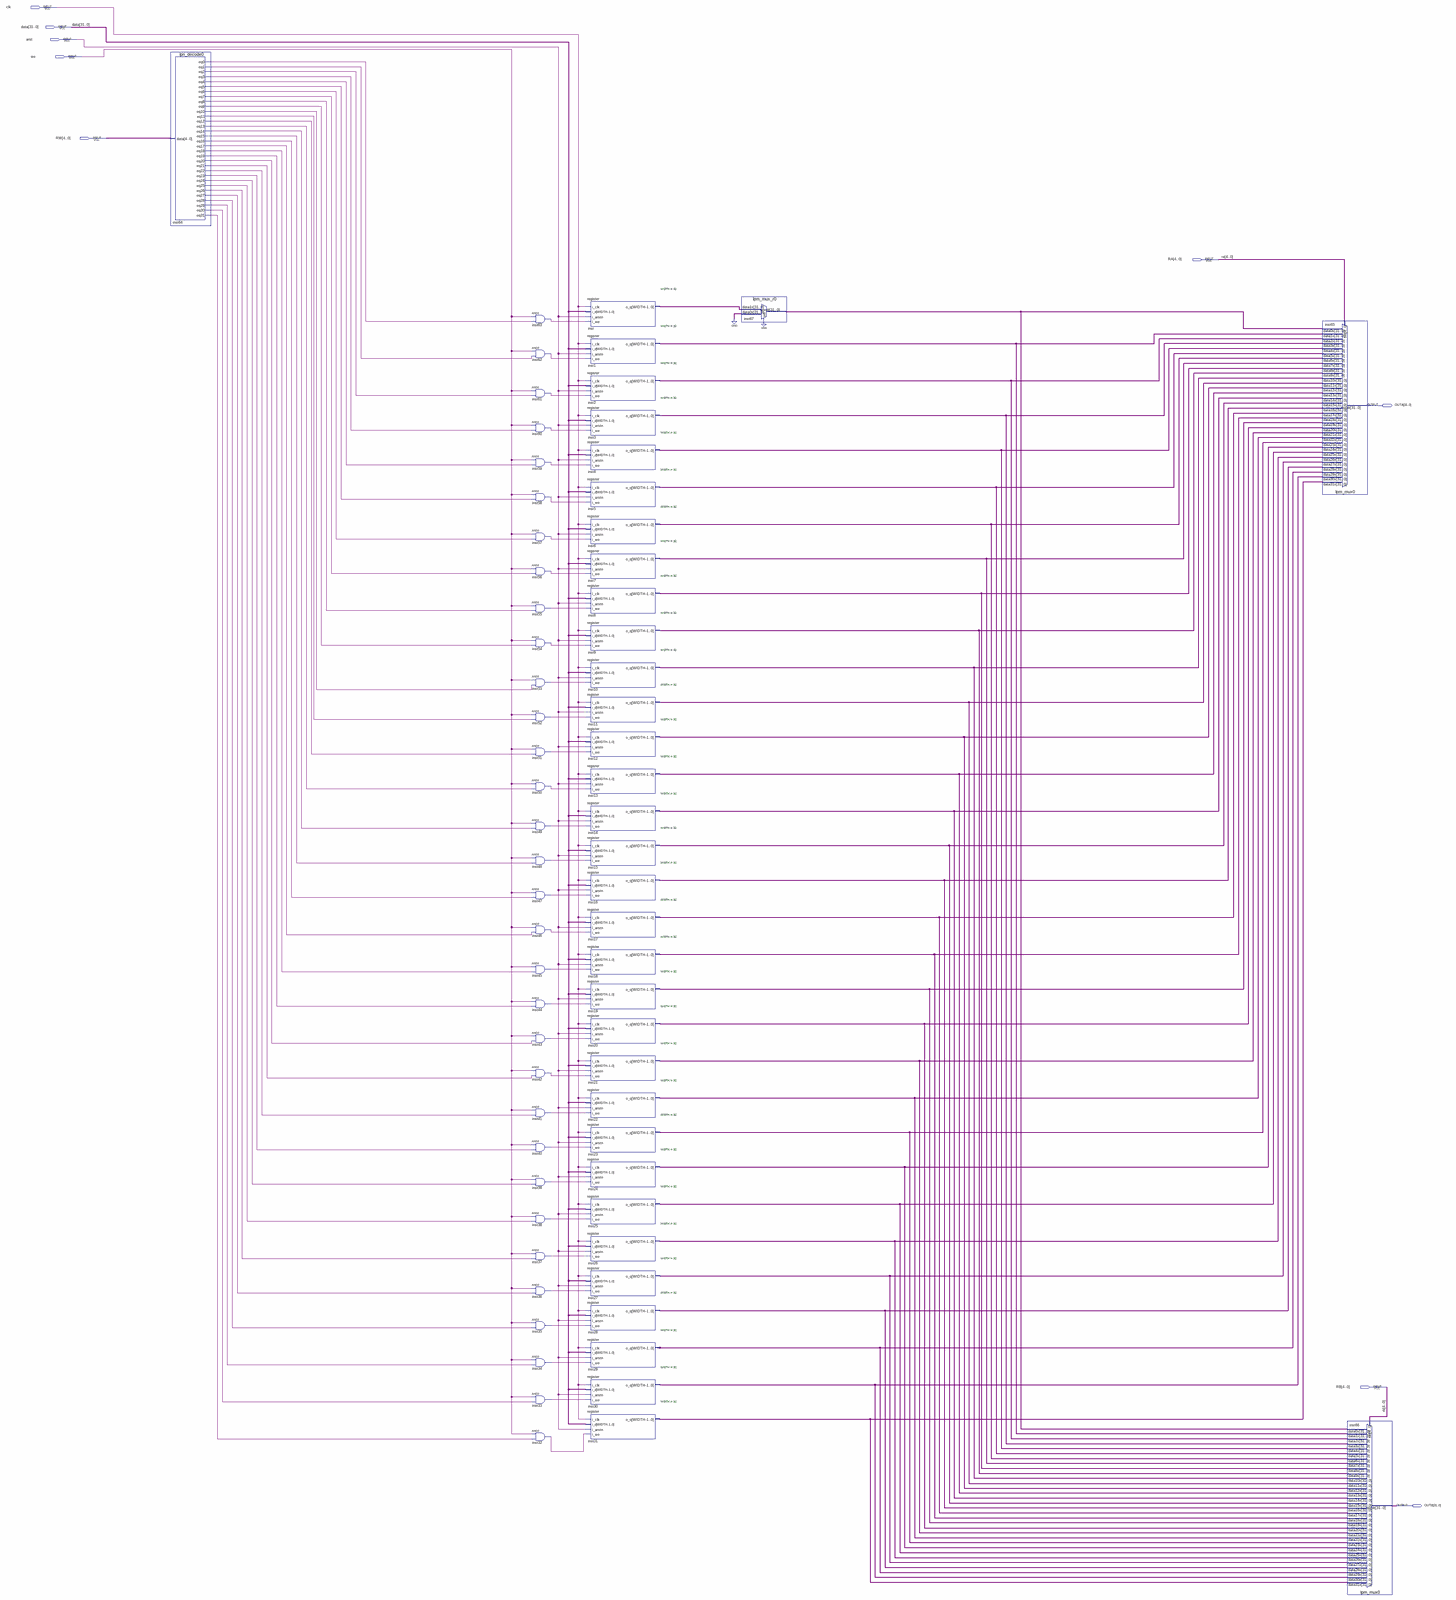
[diagram p0: schematic sheet, whole]
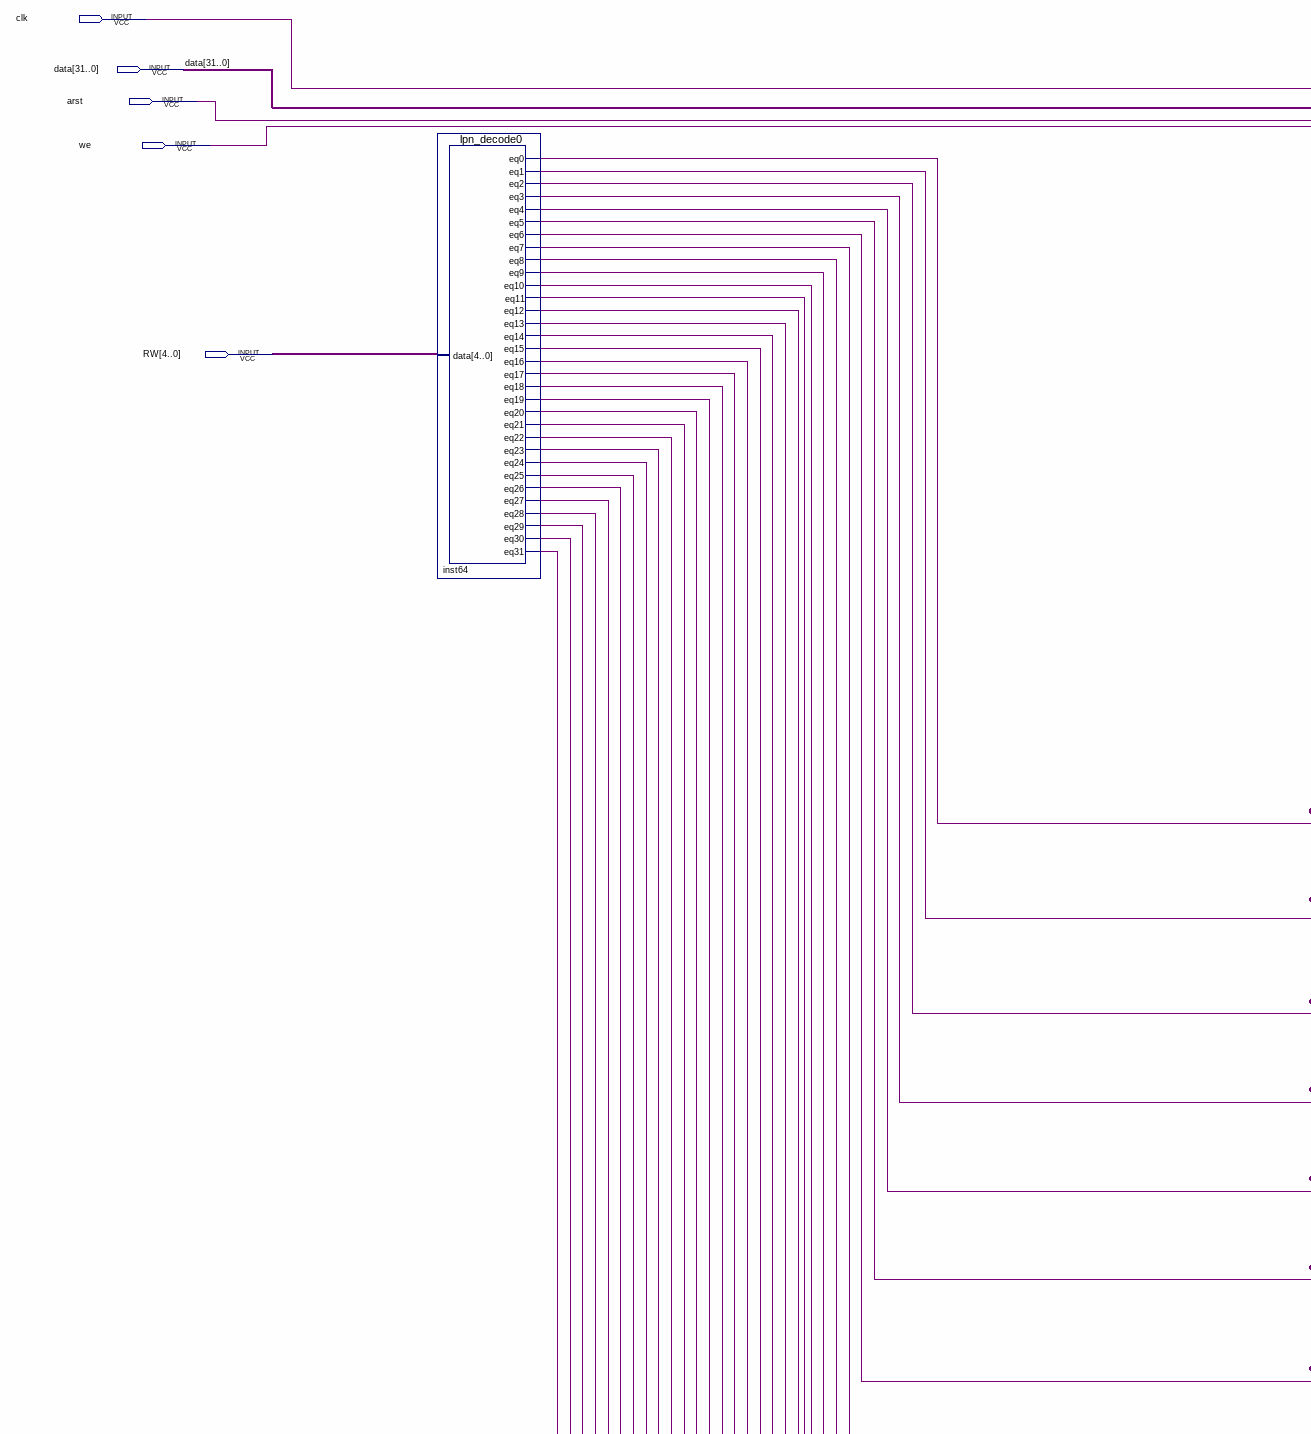
[diagram p1: schematic sheet, upper left part]
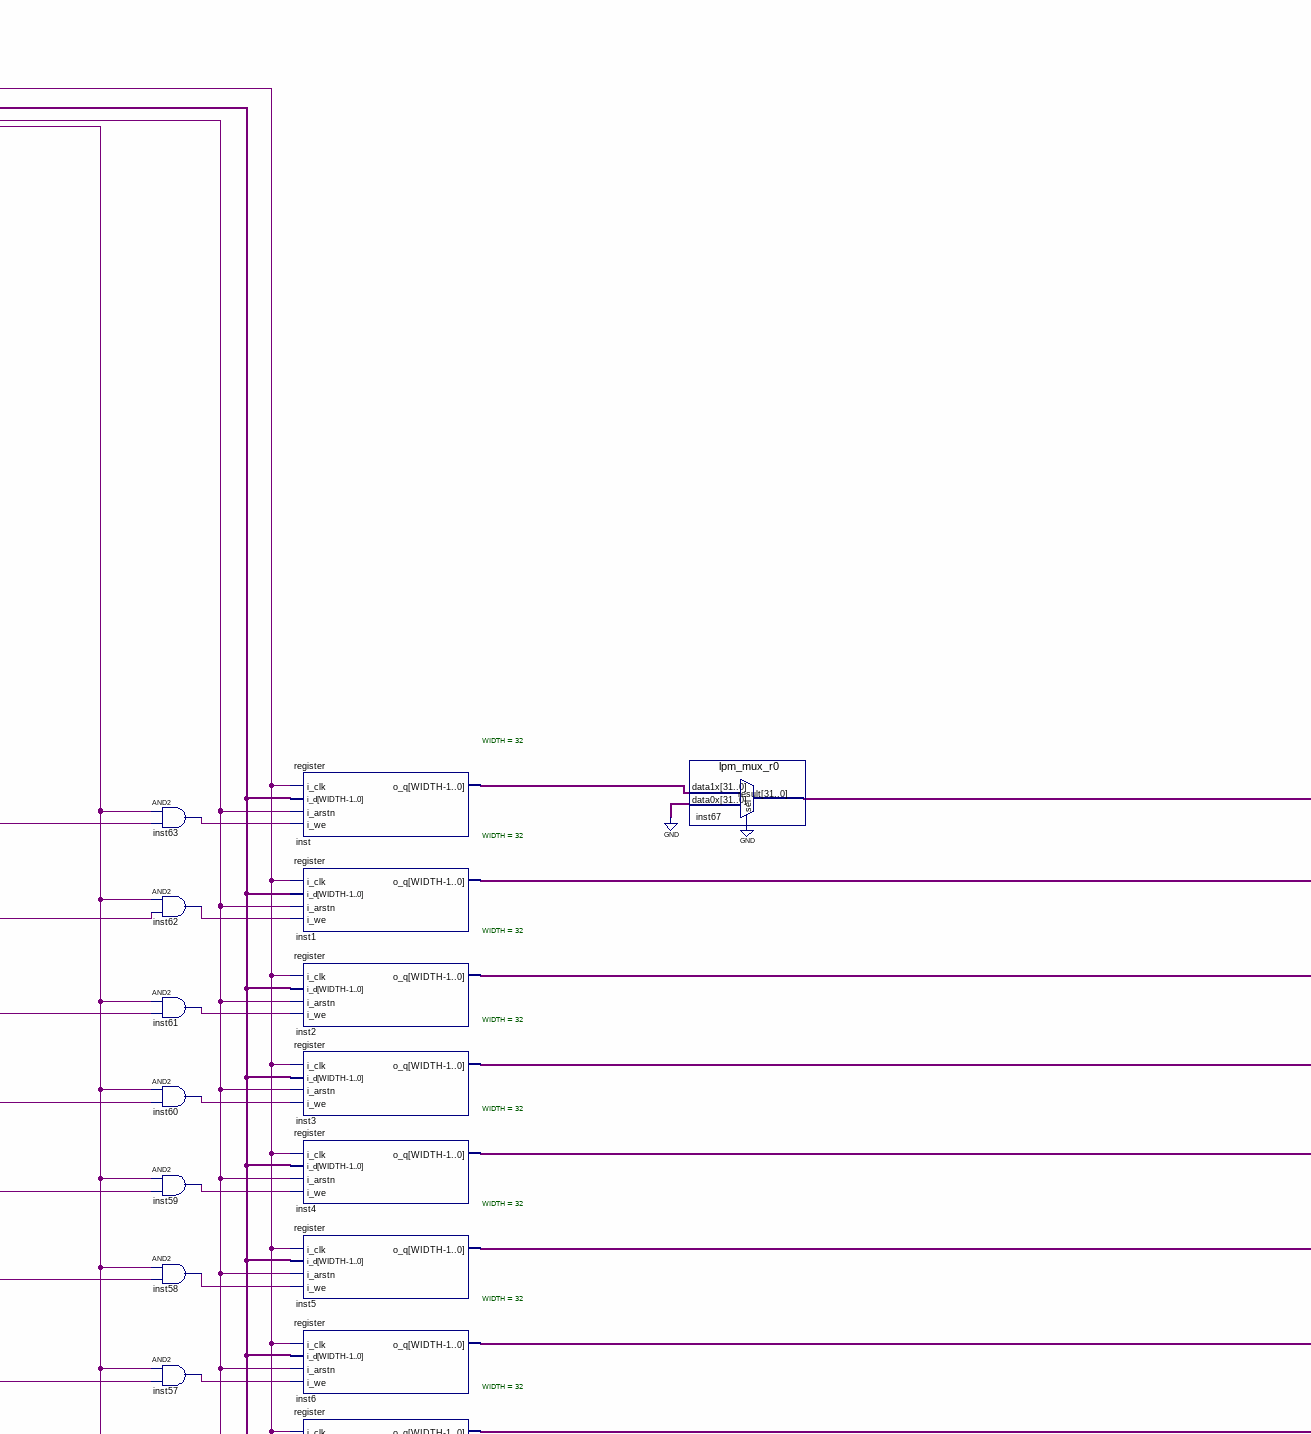
[diagram p2: schematic sheet, upper centre part]
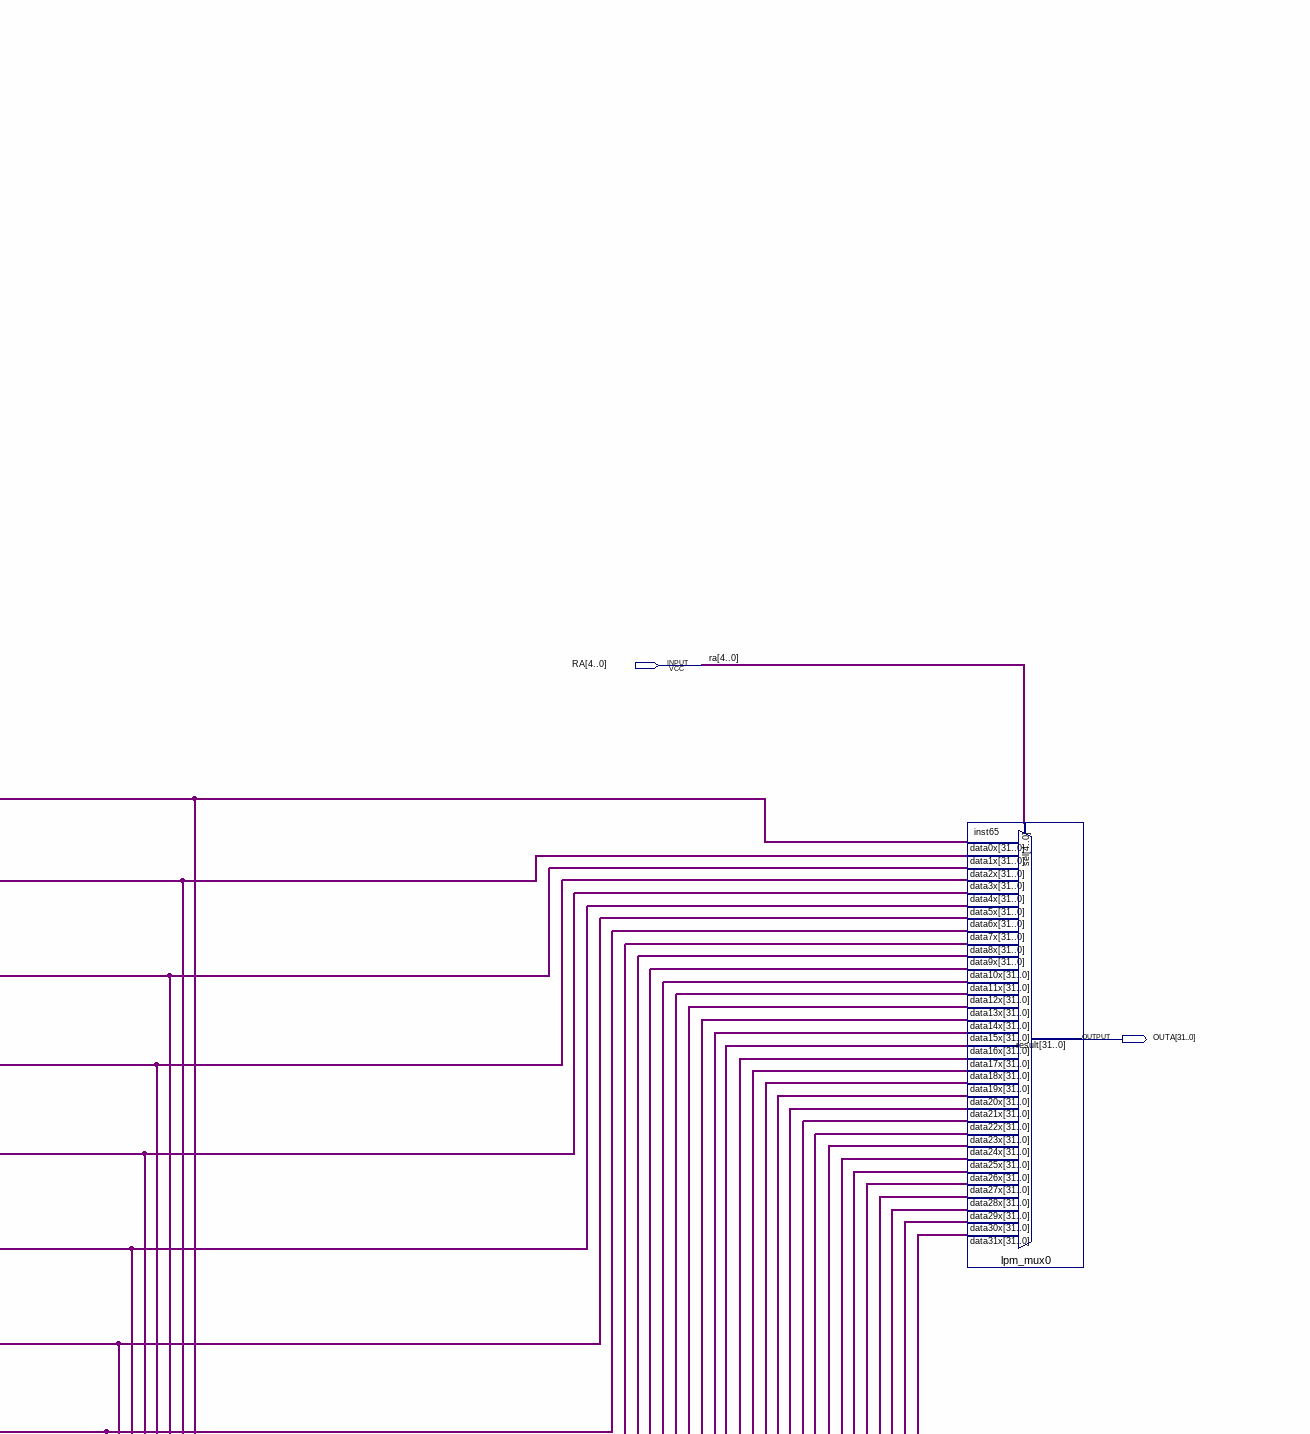
[diagram p3: schematic sheet, upper right part]
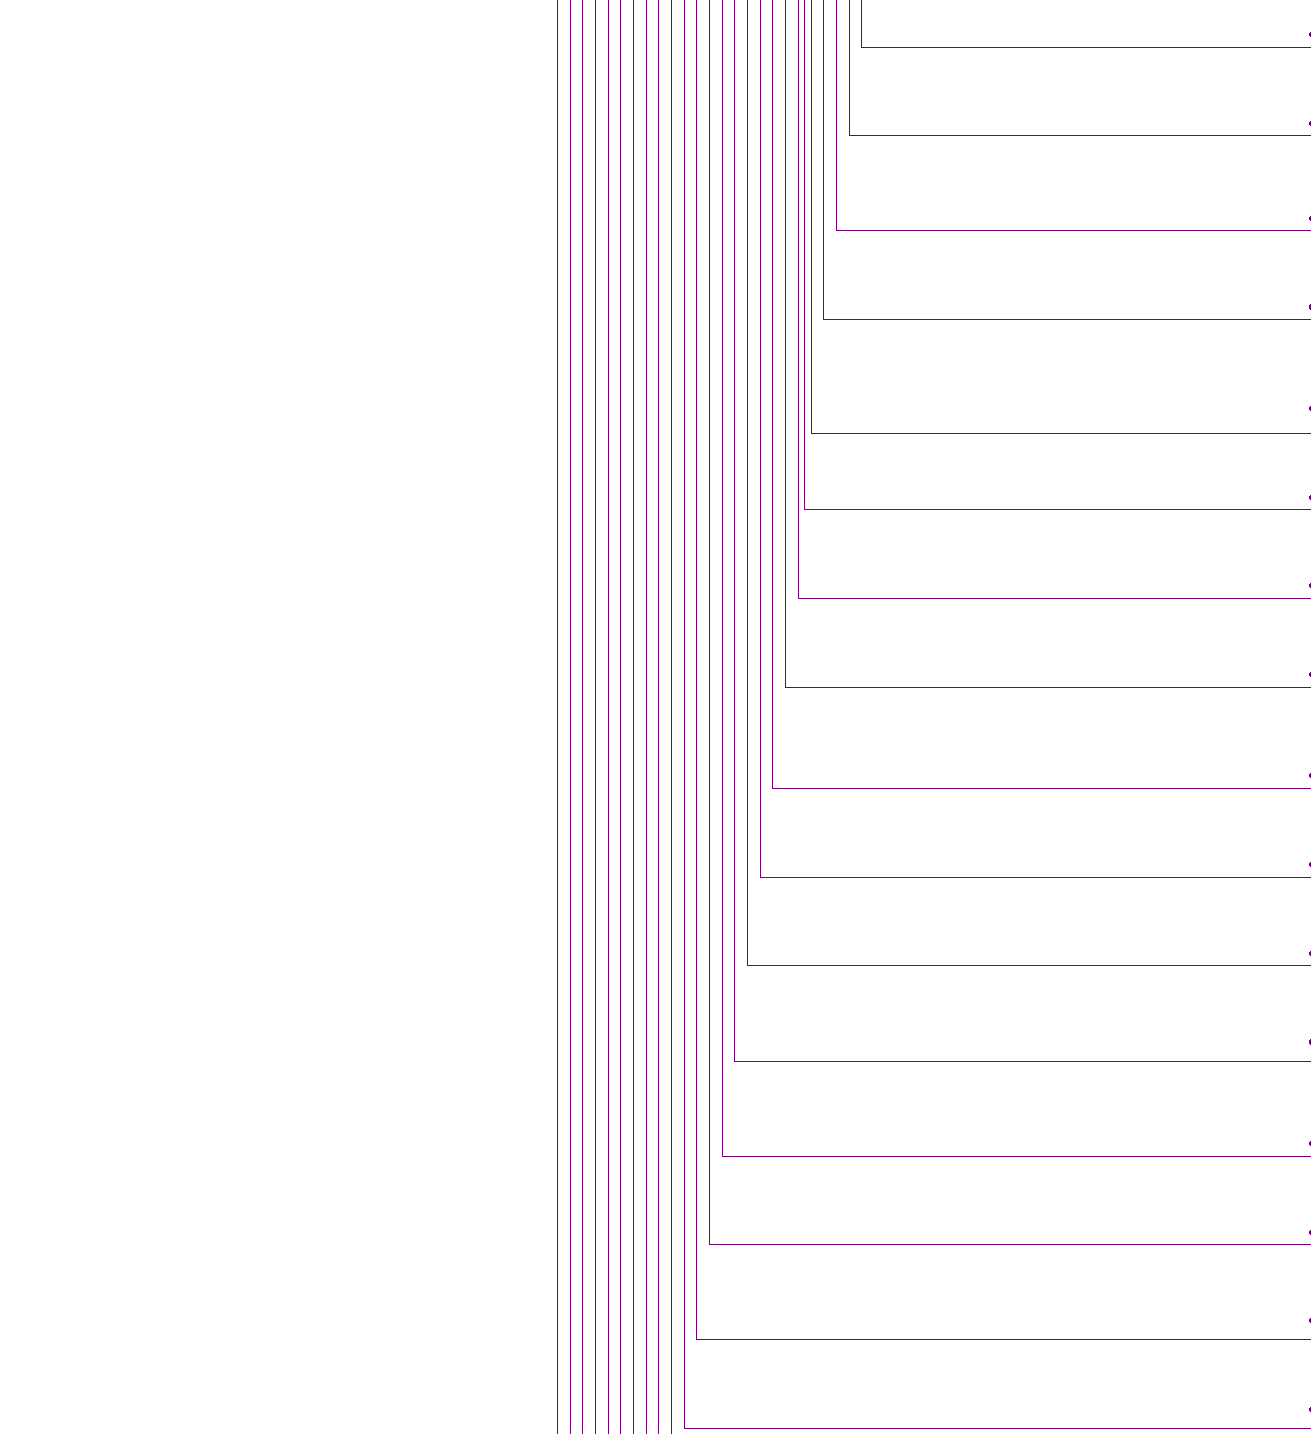
[diagram p4: schematic sheet, middle left part]
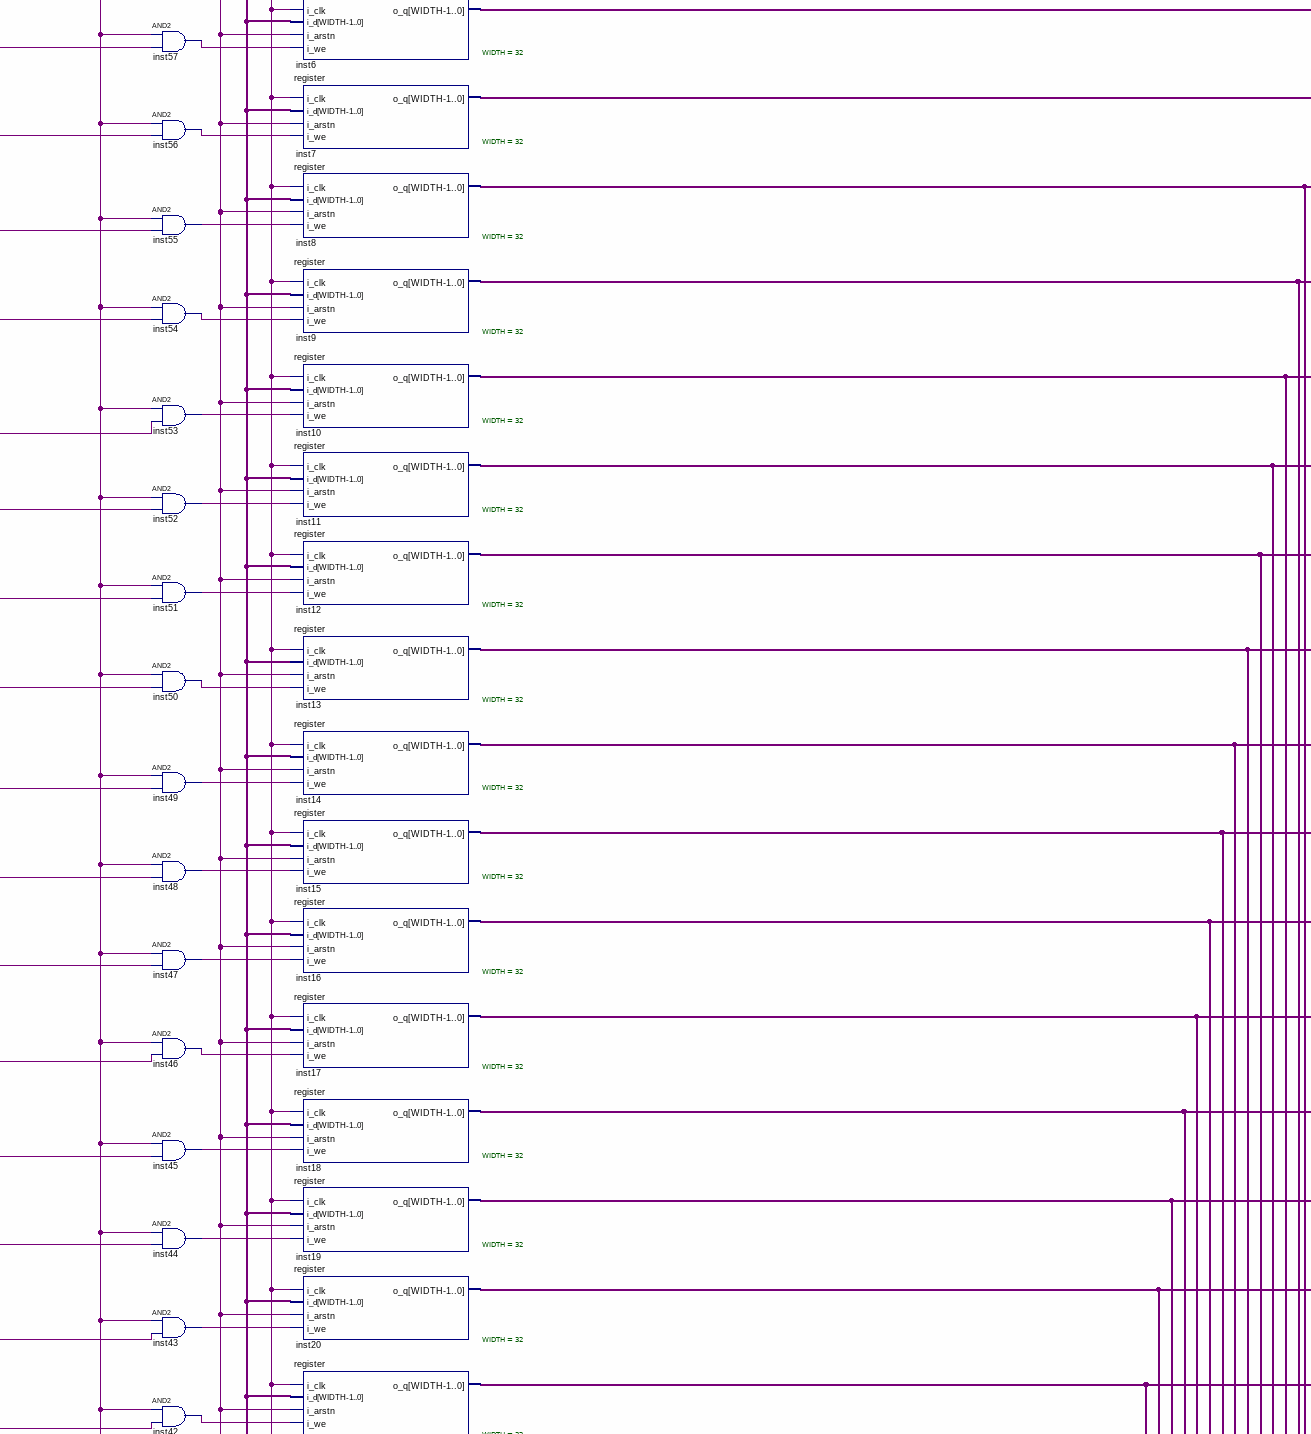
[diagram p5: schematic sheet, middle centre part]
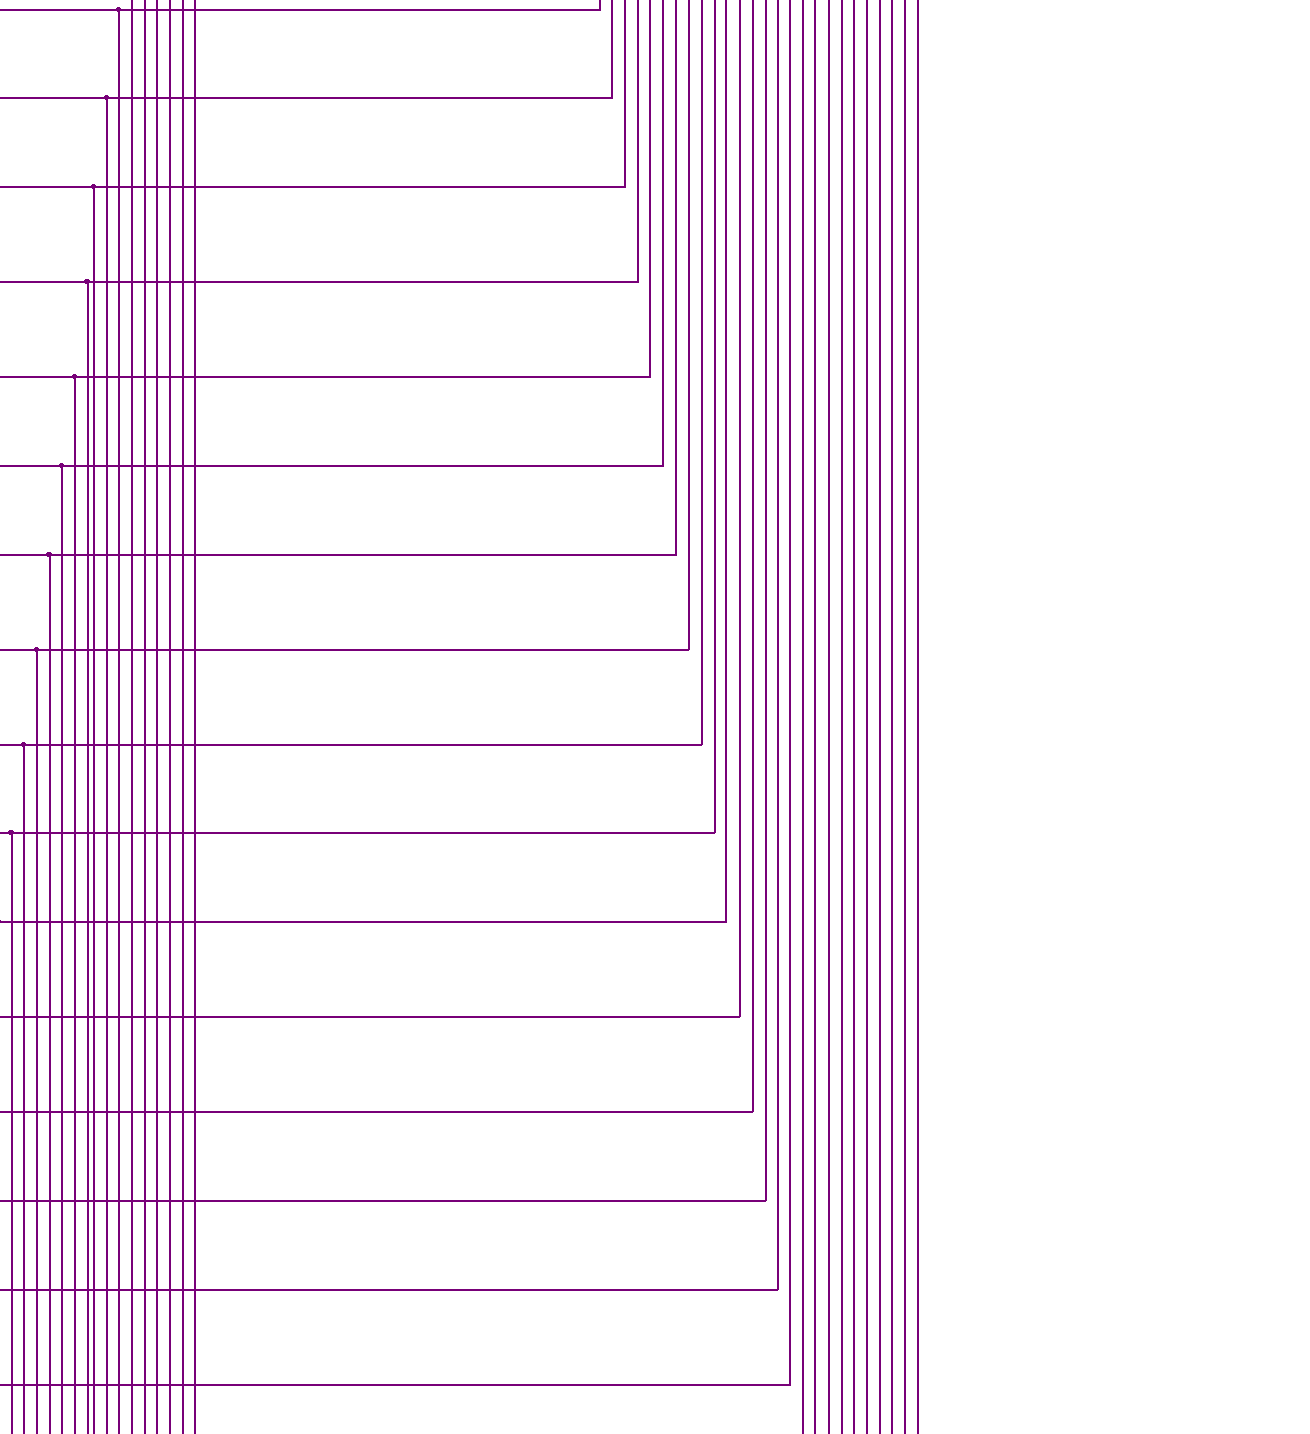
[diagram p6: schematic sheet, middle right part]
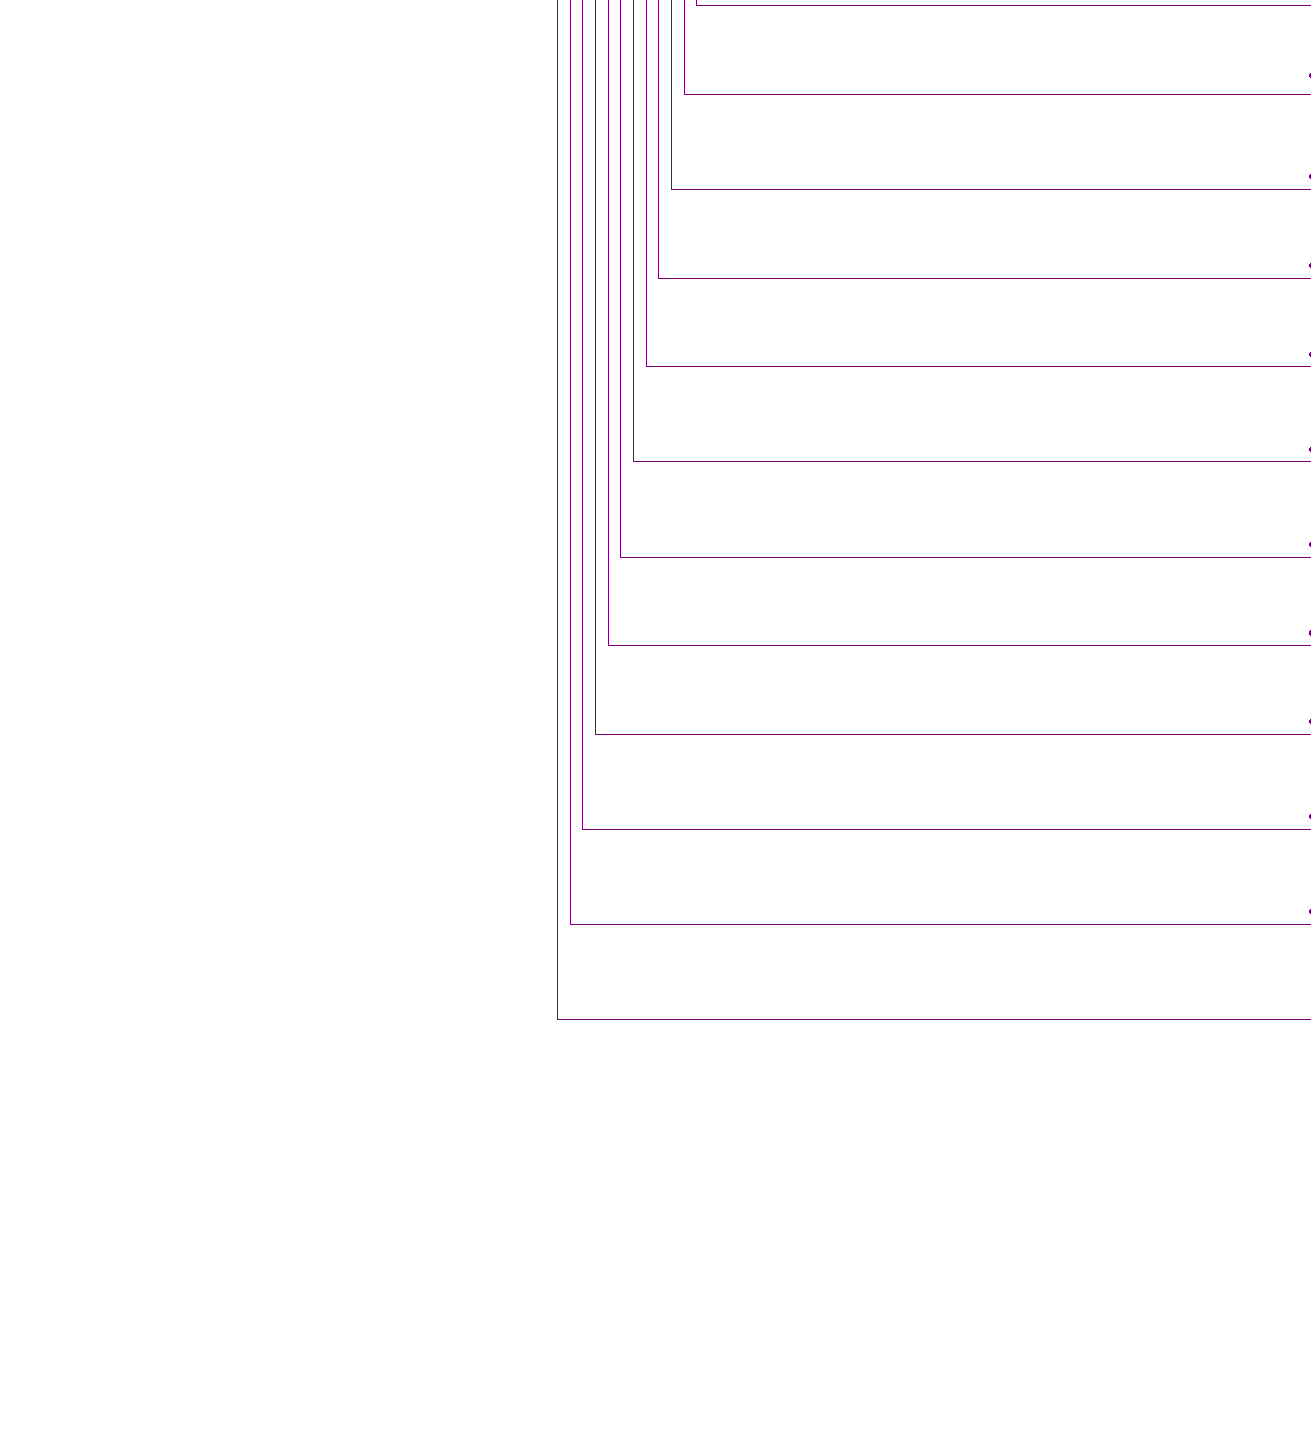
[diagram p7: schematic sheet, lower left part]
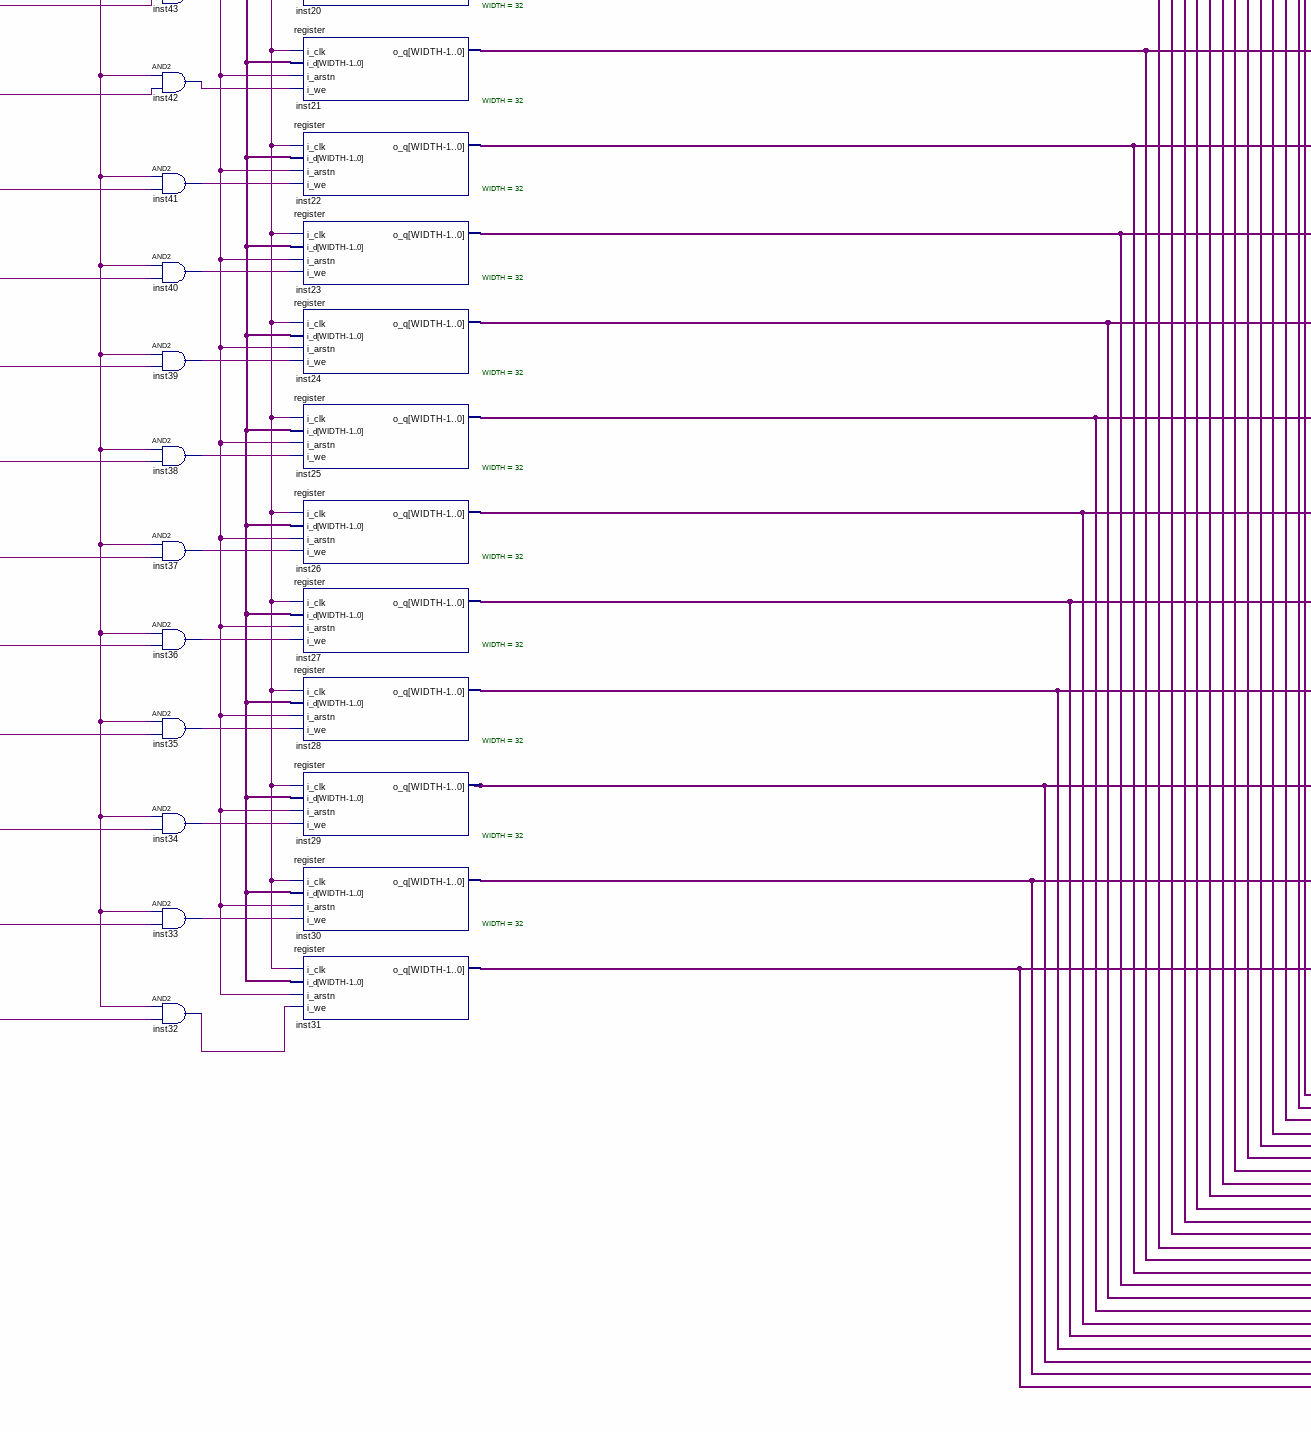
[diagram p8: schematic sheet, lower centre part]
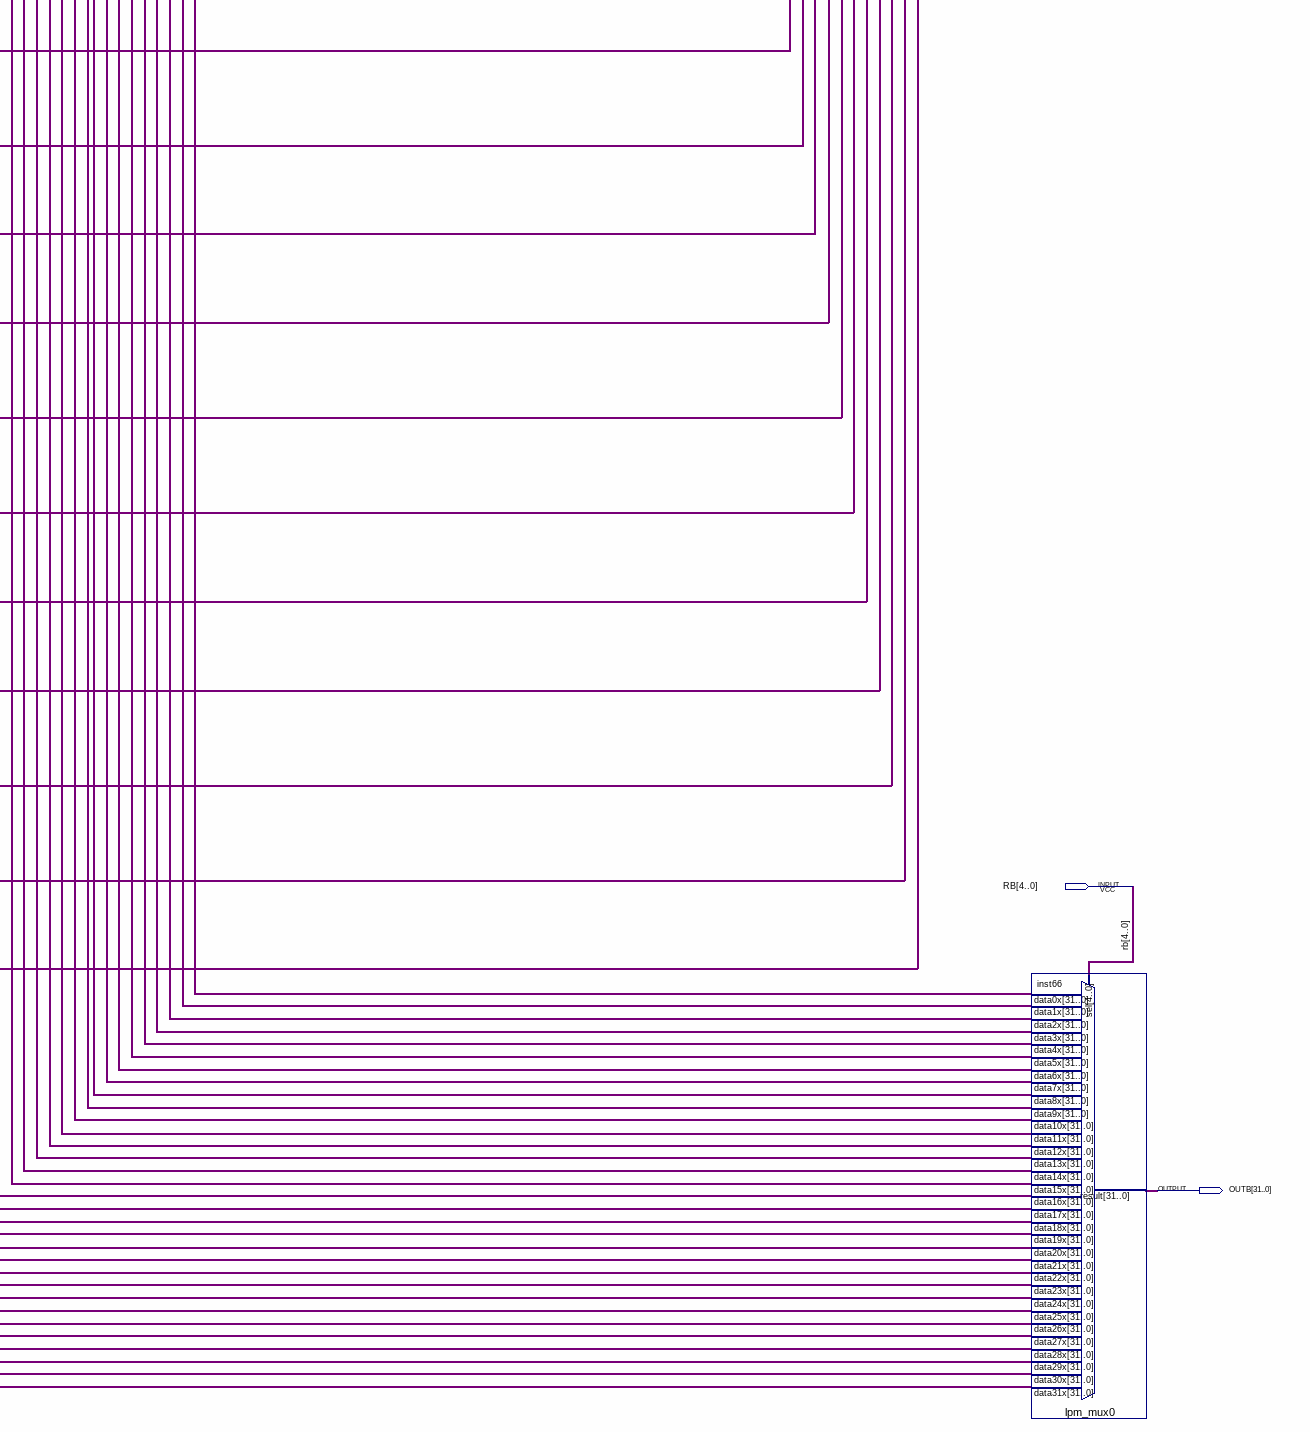
[diagram p9: schematic sheet, lower right part]
// Quartus schematic lab2.bdf as structural Verilog: 68 symbols, 9 pins
module lab2 (
  input  clk,
  input  [31:0] data,
  input  arst,
  input  we,
  input  [4:0] RW,
  input  [4:0] RA,
  input  [4:0] RB,
  output [31:0] OUTA,
  output [31:0] OUTB
);

  wire inst32_out, inst33_out, inst34_out, inst35_out, inst36_out, inst37_out, inst38_out, inst39_out,
       inst40_out, inst41_out, inst42_out, inst43_out, inst44_out, inst45_out, inst46_out, inst47_out,
       inst48_out, inst49_out, inst50_out, inst51_out, inst52_out, inst53_out, inst54_out, inst55_out,
       inst56_out, inst57_out, inst58_out, inst59_out, inst60_out, inst61_out, inst62_out, inst63_out,
       inst64_eq0, inst64_eq1, inst64_eq2, inst64_eq3, inst64_eq4, inst64_eq5, inst64_eq6, inst64_eq7,
       inst64_eq8, inst64_eq9, inst64_eq10, inst64_eq11, inst64_eq12, inst64_eq13, inst64_eq14, inst64_eq15,
       inst64_eq16, inst64_eq17, inst64_eq18, inst64_eq19, inst64_eq20, inst64_eq21, inst64_eq22,
       inst64_eq23, inst64_eq24, inst64_eq25, inst64_eq26, inst64_eq27, inst64_eq28, inst64_eq29,
       inst64_eq30, inst64_eq31;
  wire [31:0] inst1_o_q, inst2_o_q, inst3_o_q, inst4_o_q, inst5_o_q, inst6_o_q, inst7_o_q, inst8_o_q,
       inst9_o_q, inst10_o_q, inst11_o_q, inst12_o_q, inst13_o_q, inst14_o_q, inst15_o_q, inst16_o_q,
       inst17_o_q, inst18_o_q, inst19_o_q, inst20_o_q, inst21_o_q, inst22_o_q, inst23_o_q, inst24_o_q,
       inst25_o_q, inst26_o_q, inst27_o_q, inst28_o_q, inst29_o_q, inst30_o_q, inst31_o_q, inst67_result,
       inst_o_q;

  lpn_decode0 inst64 (
    .data(RW), .eq0(inst64_eq0), .eq1(inst64_eq1), .eq2(inst64_eq2), .eq3(inst64_eq3), .eq4(inst64_eq4),
    .eq5(inst64_eq5), .eq6(inst64_eq6), .eq7(inst64_eq7), .eq8(inst64_eq8), .eq9(inst64_eq9),
    .eq10(inst64_eq10), .eq11(inst64_eq11), .eq12(inst64_eq12), .eq13(inst64_eq13), .eq14(inst64_eq14),
    .eq15(inst64_eq15), .eq16(inst64_eq16), .eq17(inst64_eq17), .eq18(inst64_eq18), .eq19(inst64_eq19),
    .eq20(inst64_eq20), .eq21(inst64_eq21), .eq22(inst64_eq22), .eq23(inst64_eq23), .eq24(inst64_eq24),
    .eq25(inst64_eq25), .eq26(inst64_eq26), .eq27(inst64_eq27), .eq28(inst64_eq28), .eq29(inst64_eq29),
    .eq30(inst64_eq30), .eq31(inst64_eq31));
  and inst63 (inst63_out, we, inst64_eq0);
  and inst62 (inst62_out, we, inst64_eq1);
  and inst61 (inst61_out, we, inst64_eq2);
  and inst60 (inst60_out, we, inst64_eq3);
  and inst59 (inst59_out, we, inst64_eq4);
  and inst58 (inst58_out, we, inst64_eq5);
  and inst57 (inst57_out, we, inst64_eq6);
  and inst56 (inst56_out, we, inst64_eq7);
  and inst55 (inst55_out, we, inst64_eq8);
  and inst54 (inst54_out, we, inst64_eq9);
  and inst53 (inst53_out, we, inst64_eq10);
  and inst52 (inst52_out, we, inst64_eq11);
  and inst51 (inst51_out, we, inst64_eq12);
  and inst50 (inst50_out, we, inst64_eq13);
  and inst49 (inst49_out, we, inst64_eq14);
  and inst48 (inst48_out, we, inst64_eq15);
  and inst47 (inst47_out, we, inst64_eq16);
  and inst46 (inst46_out, we, inst64_eq17);
  and inst45 (inst45_out, we, inst64_eq18);
  and inst44 (inst44_out, we, inst64_eq19);
  and inst43 (inst43_out, we, inst64_eq20);
  and inst42 (inst42_out, we, inst64_eq21);
  and inst41 (inst41_out, we, inst64_eq22);
  and inst40 (inst40_out, we, inst64_eq23);
  and inst39 (inst39_out, we, inst64_eq24);
  and inst38 (inst38_out, we, inst64_eq25);
  and inst37 (inst37_out, we, inst64_eq26);
  and inst36 (inst36_out, we, inst64_eq27);
  and inst35 (inst35_out, we, inst64_eq28);
  and inst34 (inst34_out, we, inst64_eq29);
  and inst33 (inst33_out, we, inst64_eq30);
  and inst32 (inst32_out, we, inst64_eq31);
  register #(.WIDTH(32)) inst (.i_clk(clk), .i_d(data), .i_arstn(arst), .i_we(inst63_out), .o_q(inst_o_q));
  register #(.WIDTH(32)) inst1 (.i_clk(clk), .i_d(data), .i_arstn(arst), .i_we(inst62_out), .o_q(inst1_o_q));
  register #(.WIDTH(32)) inst2 (.i_clk(clk), .i_d(data), .i_arstn(arst), .i_we(inst61_out), .o_q(inst2_o_q));
  register #(.WIDTH(32)) inst3 (.i_clk(clk), .i_d(data), .i_arstn(arst), .i_we(inst60_out), .o_q(inst3_o_q));
  register #(.WIDTH(32)) inst4 (.i_clk(clk), .i_d(data), .i_arstn(arst), .i_we(inst59_out), .o_q(inst4_o_q));
  register #(.WIDTH(32)) inst5 (.i_clk(clk), .i_d(data), .i_arstn(arst), .i_we(inst58_out), .o_q(inst5_o_q));
  register #(.WIDTH(32)) inst6 (.i_clk(clk), .i_d(data), .i_arstn(arst), .i_we(inst57_out), .o_q(inst6_o_q));
  register #(.WIDTH(32)) inst7 (.i_clk(clk), .i_d(data), .i_arstn(arst), .i_we(inst56_out), .o_q(inst7_o_q));
  register #(.WIDTH(32)) inst8 (.i_clk(clk), .i_d(data), .i_arstn(arst), .i_we(inst55_out), .o_q(inst8_o_q));
  register #(.WIDTH(32)) inst9 (.i_clk(clk), .i_d(data), .i_arstn(arst), .i_we(inst54_out), .o_q(inst9_o_q));
  register #(.WIDTH(32)) inst10 (.i_clk(clk), .i_d(data), .i_arstn(arst), .i_we(inst53_out), .o_q(inst10_o_q));
  register #(.WIDTH(32)) inst11 (.i_clk(clk), .i_d(data), .i_arstn(arst), .i_we(inst52_out), .o_q(inst11_o_q));
  register #(.WIDTH(32)) inst12 (.i_clk(clk), .i_d(data), .i_arstn(arst), .i_we(inst51_out), .o_q(inst12_o_q));
  register #(.WIDTH(32)) inst13 (.i_clk(clk), .i_d(data), .i_arstn(arst), .i_we(inst50_out), .o_q(inst13_o_q));
  register #(.WIDTH(32)) inst14 (.i_clk(clk), .i_d(data), .i_arstn(arst), .i_we(inst49_out), .o_q(inst14_o_q));
  register #(.WIDTH(32)) inst15 (.i_clk(clk), .i_d(data), .i_arstn(arst), .i_we(inst48_out), .o_q(inst15_o_q));
  register #(.WIDTH(32)) inst16 (.i_clk(clk), .i_d(data), .i_arstn(arst), .i_we(inst47_out), .o_q(inst16_o_q));
  register #(.WIDTH(32)) inst17 (.i_clk(clk), .i_d(data), .i_arstn(arst), .i_we(inst46_out), .o_q(inst17_o_q));
  register #(.WIDTH(32)) inst18 (.i_clk(clk), .i_d(data), .i_arstn(arst), .i_we(inst45_out), .o_q(inst18_o_q));
  register #(.WIDTH(32)) inst19 (.i_clk(clk), .i_d(data), .i_arstn(arst), .i_we(inst44_out), .o_q(inst19_o_q));
  register #(.WIDTH(32)) inst20 (.i_clk(clk), .i_d(data), .i_arstn(arst), .i_we(inst43_out), .o_q(inst20_o_q));
  register #(.WIDTH(32)) inst21 (.i_clk(clk), .i_d(data), .i_arstn(arst), .i_we(inst42_out), .o_q(inst21_o_q));
  register #(.WIDTH(32)) inst22 (.i_clk(clk), .i_d(data), .i_arstn(arst), .i_we(inst41_out), .o_q(inst22_o_q));
  register #(.WIDTH(32)) inst23 (.i_clk(clk), .i_d(data), .i_arstn(arst), .i_we(inst40_out), .o_q(inst23_o_q));
  register #(.WIDTH(32)) inst24 (.i_clk(clk), .i_d(data), .i_arstn(arst), .i_we(inst39_out), .o_q(inst24_o_q));
  register #(.WIDTH(32)) inst25 (.i_clk(clk), .i_d(data), .i_arstn(arst), .i_we(inst38_out), .o_q(inst25_o_q));
  register #(.WIDTH(32)) inst26 (.i_clk(clk), .i_d(data), .i_arstn(arst), .i_we(inst37_out), .o_q(inst26_o_q));
  register #(.WIDTH(32)) inst27 (.i_clk(clk), .i_d(data), .i_arstn(arst), .i_we(inst36_out), .o_q(inst27_o_q));
  register #(.WIDTH(32)) inst28 (.i_clk(clk), .i_d(data), .i_arstn(arst), .i_we(inst35_out), .o_q(inst28_o_q));
  register #(.WIDTH(32)) inst29 (.i_clk(clk), .i_d(data), .i_arstn(arst), .i_we(inst34_out), .o_q(inst29_o_q));
  register #(.WIDTH(32)) inst30 (.i_clk(clk), .i_d(data), .i_arstn(arst), .i_we(inst33_out), .o_q(inst30_o_q));
  register #(.WIDTH(32)) inst31 (.i_clk(clk), .i_d(data), .i_arstn(arst), .i_we(inst32_out), .o_q(inst31_o_q));
  lpm_mux_r0 inst67 (.data1x(inst_o_q), .data0x({32{1'b0}}), .sel(1'b0), .result(inst67_result));
  lpm_mux0 inst65 (
    .data31x(inst31_o_q), .data30x(inst30_o_q), .data29x(inst29_o_q), .data28x(inst28_o_q),
    .data27x(inst27_o_q), .data26x(inst26_o_q), .data25x(inst25_o_q), .data24x(inst24_o_q),
    .data23x(inst23_o_q), .data22x(inst22_o_q), .data21x(inst21_o_q), .data20x(inst20_o_q),
    .data19x(inst19_o_q), .data18x(inst18_o_q), .data17x(inst17_o_q), .data16x(inst16_o_q),
    .data15x(inst15_o_q), .data14x(inst14_o_q), .data13x(inst13_o_q), .data12x(inst12_o_q),
    .data11x(inst11_o_q), .data10x(inst10_o_q), .data9x(inst9_o_q), .data8x(inst8_o_q), .data7x(inst7_o_q),
    .data6x(inst6_o_q), .data5x(inst5_o_q), .data4x(inst4_o_q), .data3x(inst3_o_q), .data2x(inst2_o_q),
    .data1x(inst1_o_q), .data0x(inst67_result), .sel(RA), .result(OUTA));
  lpm_mux0 inst66 (
    .data31x(inst31_o_q), .data30x(inst30_o_q), .data29x(inst29_o_q), .data28x(inst28_o_q),
    .data27x(inst27_o_q), .data26x(inst26_o_q), .data25x(inst25_o_q), .data24x(inst24_o_q),
    .data23x(inst23_o_q), .data22x(inst22_o_q), .data21x(inst21_o_q), .data20x(inst20_o_q),
    .data19x(inst19_o_q), .data18x(inst18_o_q), .data17x(inst17_o_q), .data16x(inst16_o_q),
    .data15x(inst15_o_q), .data14x(inst14_o_q), .data13x(inst13_o_q), .data12x(inst12_o_q),
    .data11x(inst11_o_q), .data10x(inst10_o_q), .data9x(inst9_o_q), .data8x(inst8_o_q), .data7x(inst7_o_q),
    .data6x(inst6_o_q), .data5x(inst5_o_q), .data4x(inst4_o_q), .data3x(inst3_o_q), .data2x(inst2_o_q),
    .data1x(inst1_o_q), .data0x(inst67_result), .sel(RB), .result(OUTB));
endmodule
